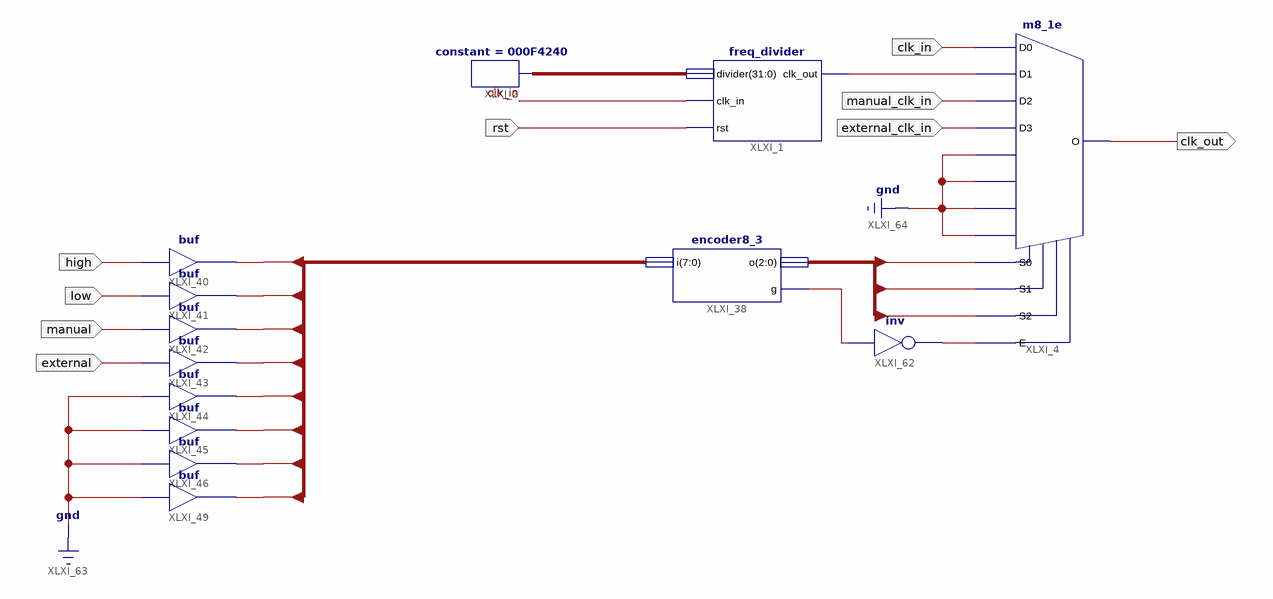
[diagram p0: schematic sheet 1]
// Xilinx ISE schematic cpu_freq_divider.sch (aspartan6) as structural Verilog: 13 symbols, 9 ports
module cpu_freq_divider (
  input  clk_in,
  input  low,
  input  external,
  input  high,
  input  manual,
  input  rst,
  input  manual_clk_in,
  input  external_clk_in,
  output clk_out
);

  wire XLXN_92, XLXN_98, XLXN_99;
  wire [2:0] in_enc;
  wire [7:0] enc_in;
  wire [31:0] XLXN_1;

  m8_1e XLXI_4 (
    .D0(clk_in), .D1(XLXN_92), .D2(manual_clk_in), .D3(external_clk_in), .D4(1'b0), .D5(1'b0), .D6(1'b0),
    .D7(1'b0), .E(XLXN_98), .S0(in_enc[0]), .S1(in_enc[1]), .S2(in_enc[2]), .O(clk_out));
  encoder8_3 XLXI_38 (.g(XLXN_99), .i(enc_in), .o(in_enc));
  buf XLXI_40 (enc_in[0], high);
  buf XLXI_41 (enc_in[1], low);
  buf XLXI_42 (enc_in[2], manual);
  buf XLXI_43 (enc_in[3], external);
  buf XLXI_44 (enc_in[4], 1'b0);
  buf XLXI_45 (enc_in[5], 1'b0);
  buf XLXI_46 (enc_in[6], 1'b0);
  buf XLXI_49 (enc_in[7], 1'b0);
  constant #(.CValue("000F4240")) XLXI_2 (.O(XLXN_1));
  freq_divider XLXI_1 (.clk_in(clk_in), .clk_out(XLXN_92), .divider(XLXN_1), .rst(rst));
  not XLXI_62 (XLXN_98, XLXN_99);
endmodule
